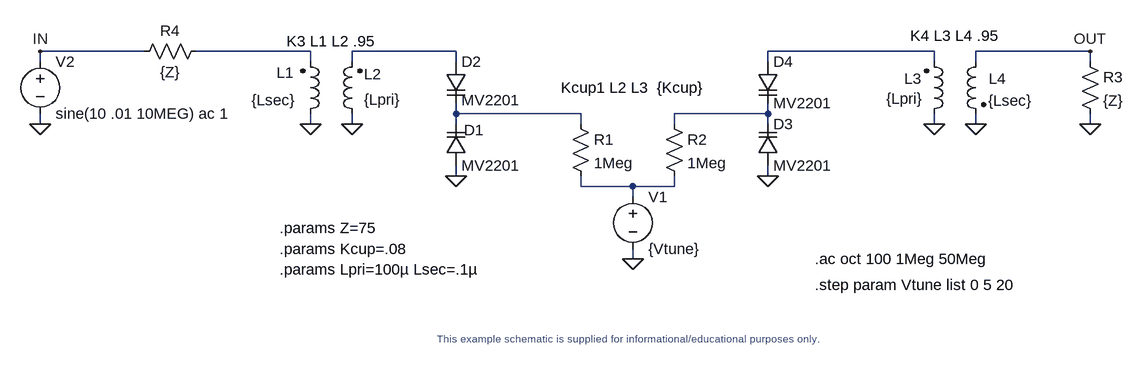
[diagram p0: schematic varactor.asc]
varactor.asc, the LTspice schematic file:
Version 4
SHEET 1 3656 2392
WIRE 2128 912 1968 912
WIRE 2384 912 2208 912
WIRE 2608 912 2448 912
WIRE 3344 912 3088 912
WIRE 3584 912 3408 912
WIRE 1968 928 1968 912
WIRE 2384 928 2384 912
WIRE 2448 928 2448 912
WIRE 2608 928 2608 912
WIRE 3088 928 3088 912
WIRE 3344 928 3344 912
WIRE 3408 928 3408 912
WIRE 3584 928 3584 912
WIRE 2608 1008 2608 992
WIRE 2800 1008 2608 1008
WIRE 3088 1008 3088 992
WIRE 3088 1008 2944 1008
WIRE 1968 1024 1968 1008
WIRE 2384 1024 2384 1008
WIRE 2448 1024 2448 1008
WIRE 2608 1024 2608 1008
WIRE 2800 1024 2800 1008
WIRE 2944 1024 2944 1008
WIRE 3088 1024 3088 1008
WIRE 3344 1024 3344 1008
WIRE 3408 1024 3408 1008
WIRE 3584 1024 3584 1008
WIRE 2608 1104 2608 1088
WIRE 3088 1104 3088 1088
WIRE 2800 1120 2800 1104
WIRE 2880 1120 2800 1120
WIRE 2944 1120 2944 1104
WIRE 2944 1120 2880 1120
WIRE 2880 1136 2880 1120
WIRE 2880 1232 2880 1216
FLAG 1968 1024 0
FLAG 2608 1104 0
FLAG 2448 1024 0
FLAG 3088 1104 0
FLAG 3344 1024 0
FLAG 2384 1024 0
FLAG 3408 1024 0
FLAG 3584 1024 0
FLAG 2880 1232 0
FLAG 3584 912 OUT
FLAG 1968 912 IN
SYMBOL voltage 1968 912 R0
SYMATTR InstName V2
SYMATTR Value sine(10 .01 10MEG) ac 1
SYMBOL varactor 2592 1088 M180
WINDOW 0 28 55 Left 2
WINDOW 3 24 0 Left 2
SYMATTR InstName D1
SYMATTR Value MV2201
SYMBOL varactor 2592 928 R0
WINDOW 3 24 59 Left 2
SYMATTR Value MV2201
SYMATTR InstName D2
SYMBOL ind2 2464 1024 R180
WINDOW 0 -2 77 Right 2
WINDOW 3 -2 38 Right 2
SYMATTR InstName L2
SYMATTR Value {Lpri}
SYMBOL res 2784 1008 R0
SYMATTR InstName R1
SYMATTR Value 1Meg
SYMBOL varactor 3072 1088 M180
WINDOW 0 24 64 Left 2
WINDOW 3 24 0 Left 2
SYMATTR InstName D3
SYMATTR Value MV2201
SYMBOL varactor 3072 928 R0
SYMATTR InstName D4
SYMATTR Value MV2201
SYMBOL ind2 3328 1024 M180
WINDOW 0 -3 70 Right 2
WINDOW 3 -1 39 Right 2
SYMATTR InstName L3
SYMATTR Value {Lpri}
SYMBOL res 2928 1008 R0
SYMATTR InstName R2
SYMATTR Value 1Meg
SYMBOL ind2 3424 912 M0
WINDOW 0 -4 42 Right 2
WINDOW 3 -3 76 Right 2
SYMATTR InstName L4
SYMATTR Value {Lsec}
SYMBOL ind2 2368 1024 M180
WINDOW 0 -9 79 Right 2
WINDOW 3 -7 37 Right 2
SYMATTR InstName L1
SYMATTR Value {Lsec}
SYMBOL res 3568 912 R0
SYMATTR InstName R3
SYMATTR Value {Z}
SYMBOL res 2224 896 R90
WINDOW 0 0 56 VBottom 2
WINDOW 3 32 56 VTop 2
SYMATTR InstName R4
SYMATTR Value {Z}
SYMBOL voltage 2880 1120 R0
SYMATTR InstName V1
SYMATTR Value {Vtune}
TEXT 3160 1232 Left 2 !.ac oct 100 1Meg 50Meg
TEXT 2416 912 Bottom 2 !K3 L1 L2 .95
TEXT 3376 888 Center 2 !K4 L3 L4 .95
TEXT 2336 1184 Left 2 !.params Z=75
TEXT 2336 1216 Left 2 !.params Kcup=.08
TEXT 2336 1248 Left 2 !.params Lpri=100µ Lsec=.1µ
TEXT 2880 968 Center 2 !Kcup1 L2 L3  {Kcup}
TEXT 2864 1344 Top 1 ;This example schematic is supplied for informational/educational purposes only.
TEXT 3160 1272 Left 2 !.step param Vtune list 0 5 20

The netlist it stands for:
* varactor.asc
V2 IN 0 sine(10 .01 10MEG) ac 1
D1 0 N004 MV2201
D2 N002 N004 MV2201
L2 0 N002 {Lpri}
R1 N004 N006 1Meg
D3 0 N005 MV2201
D4 N003 N005 MV2201
L3 0 N003 {Lpri}
R2 N005 N006 1Meg
L4 OUT 0 {Lsec}
L1 0 N001 {Lsec}
R3 OUT 0 {Z}
R4 N001 IN {Z}
V1 N006 0 {Vtune}
.model D D
.lib standard.dio
.ac oct 100 1Meg 50Meg
K3 L1 L2 .95
K4 L3 L4 .95
.params Z=75
.params Kcup=.08
.params Lpri=100µ Lsec=.1µ
Kcup1 L2 L3  {Kcup}
* This example schematic is supplied for informational/educational purposes only.
.step param Vtune list 0 5 20
.backanno
.end